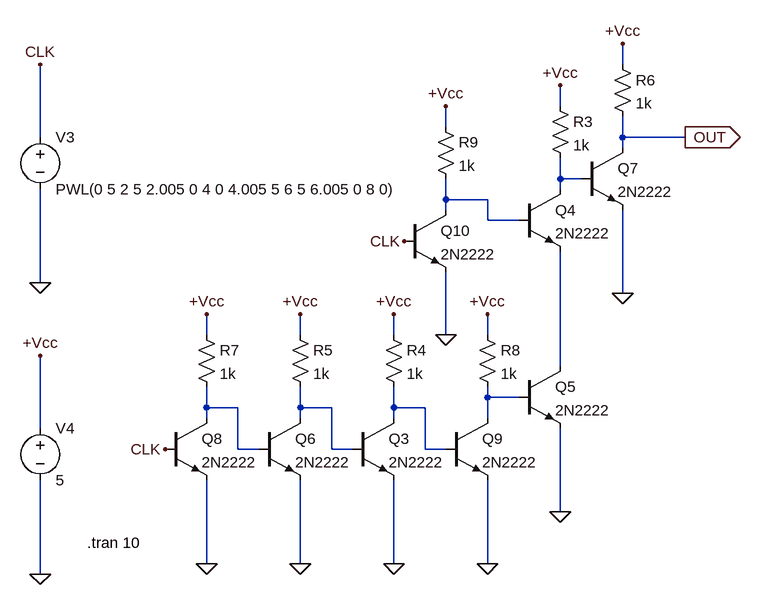
[diagram p0: schematic Falling Edge Detector .asc]
Falling Edge Detector .asc, the LTspice schematic file:
Version 4
SHEET 1 3212 1456
WIRE 2800 -192 2800 -224
WIRE 2704 -128 2704 -160
WIRE 2528 -96 2528 -128
WIRE 1904 -80 1904 -192
WIRE 2800 -80 2800 -112
WIRE 2896 -80 2800 -80
WIRE 2800 -64 2800 -80
WIRE 2704 -16 2704 -48
WIRE 2736 -16 2704 -16
WIRE 2704 0 2704 -16
WIRE 2528 16 2528 -16
WIRE 2592 16 2528 16
WIRE 2528 32 2528 16
WIRE 2592 48 2592 16
WIRE 2640 48 2592 48
WIRE 1904 144 1904 0
WIRE 2800 160 2800 32
WIRE 2160 224 2160 192
WIRE 2304 224 2304 192
WIRE 2448 224 2448 192
WIRE 2528 224 2528 128
WIRE 2592 224 2592 192
WIRE 2704 272 2704 96
WIRE 2592 320 2592 304
WIRE 2640 320 2592 320
WIRE 2160 336 2160 304
WIRE 2208 336 2160 336
WIRE 2304 336 2304 304
WIRE 2352 336 2304 336
WIRE 2448 336 2448 304
WIRE 2496 336 2448 336
WIRE 2160 352 2160 336
WIRE 2304 352 2304 336
WIRE 2448 352 2448 336
WIRE 2592 352 2592 320
WIRE 1904 368 1904 256
WIRE 2208 400 2208 336
WIRE 2240 400 2208 400
WIRE 2352 400 2352 336
WIRE 2384 400 2352 400
WIRE 2496 400 2496 336
WIRE 2528 400 2496 400
WIRE 2704 496 2704 368
WIRE 2160 576 2160 448
WIRE 2304 576 2304 448
WIRE 2448 576 2448 448
WIRE 2592 576 2592 448
WIRE 1904 592 1904 448
FLAG 2704 -160 +Vcc
FLAG 2448 576 0
FLAG 2448 192 +Vcc
FLAG 2304 576 0
FLAG 2304 192 +Vcc
FLAG 2160 576 0
FLAG 2160 192 +Vcc
FLAG 2592 576 0
FLAG 2592 192 +Vcc
FLAG 2704 496 0
FLAG 2096 400 CLK
FLAG 2528 -128 +Vcc
FLAG 2464 80 CLK
FLAG 2528 224 0
FLAG 2800 160 0
FLAG 2800 -224 +Vcc
FLAG 2896 -80 OUT
IOPIN 2896 -80 Out
FLAG 1904 -192 CLK
FLAG 1904 144 0
FLAG 1904 256 +Vcc
FLAG 1904 592 0
SYMBOL npn 2640 0 R0
SYMATTR InstName Q4
SYMATTR Value 2N2222
SYMBOL Res 2688 -144 R0
SYMATTR InstName R3
SYMATTR Value 1k
SYMBOL npn 2384 352 R0
SYMATTR InstName Q3
SYMATTR Value 2N2222
SYMBOL Res 2432 208 R0
SYMATTR InstName R4
SYMATTR Value 1k
SYMBOL npn 2240 352 R0
SYMATTR InstName Q6
SYMATTR Value 2N2222
SYMBOL Res 2288 208 R0
SYMATTR InstName R5
SYMATTR Value 1k
SYMBOL npn 2096 352 R0
SYMATTR InstName Q8
SYMATTR Value 2N2222
SYMBOL Res 2144 208 R0
SYMATTR InstName R7
SYMATTR Value 1k
SYMBOL npn 2528 352 R0
SYMATTR InstName Q9
SYMATTR Value 2N2222
SYMBOL Res 2576 208 R0
SYMATTR InstName R8
SYMATTR Value 1k
SYMBOL npn 2640 272 R0
SYMATTR InstName Q5
SYMATTR Value 2N2222
SYMBOL npn 2464 32 R0
SYMATTR InstName Q10
SYMATTR Value 2N2222
SYMBOL Res 2512 -112 R0
SYMATTR InstName R9
SYMATTR Value 1k
SYMBOL npn 2736 -64 R0
SYMATTR InstName Q7
SYMATTR Value 2N2222
SYMBOL Res 2784 -208 R0
SYMATTR InstName R6
SYMATTR Value 1k
SYMBOL voltage 1904 -96 R0
SYMATTR InstName V3
SYMATTR Value PWL(0 5 2 5 2.005 0 4 0 4.005 5 6 5 6.005 0 8 0)
SYMBOL voltage 1904 352 R0
SYMATTR InstName V4
SYMATTR Value 5
TEXT 1976 544 Left 2 !.tran 10

The netlist it stands for:
* Falling Edge Detector .asc
Q4 N001 N002 N003 0 2N2222
R3 +Vcc N001 1k
Q3 N007 N006 0 0 2N2222
R4 +Vcc N007 1k
Q6 N006 N005 0 0 2N2222
R5 +Vcc N006 1k
Q8 N005 CLK 0 0 2N2222
R7 +Vcc N005 1k
Q9 N004 N007 0 0 2N2222
R8 +Vcc N004 1k
Q5 N003 N004 0 0 2N2222
Q10 N002 CLK 0 0 2N2222
R9 +Vcc N002 1k
Q7 OUT N001 0 0 2N2222
R6 +Vcc OUT 1k
V3 CLK 0 PWL(0 5 2 5 2.005 0 4 0 4.005 5 6 5 6.005 0 8 0)
V4 +Vcc 0 5
.model NPN NPN
.model PNP PNP
.lib standard.bjt
.tran 10
.backanno
.end